# EAGLE design keyboard v2 (EAGLE 7.7.0)
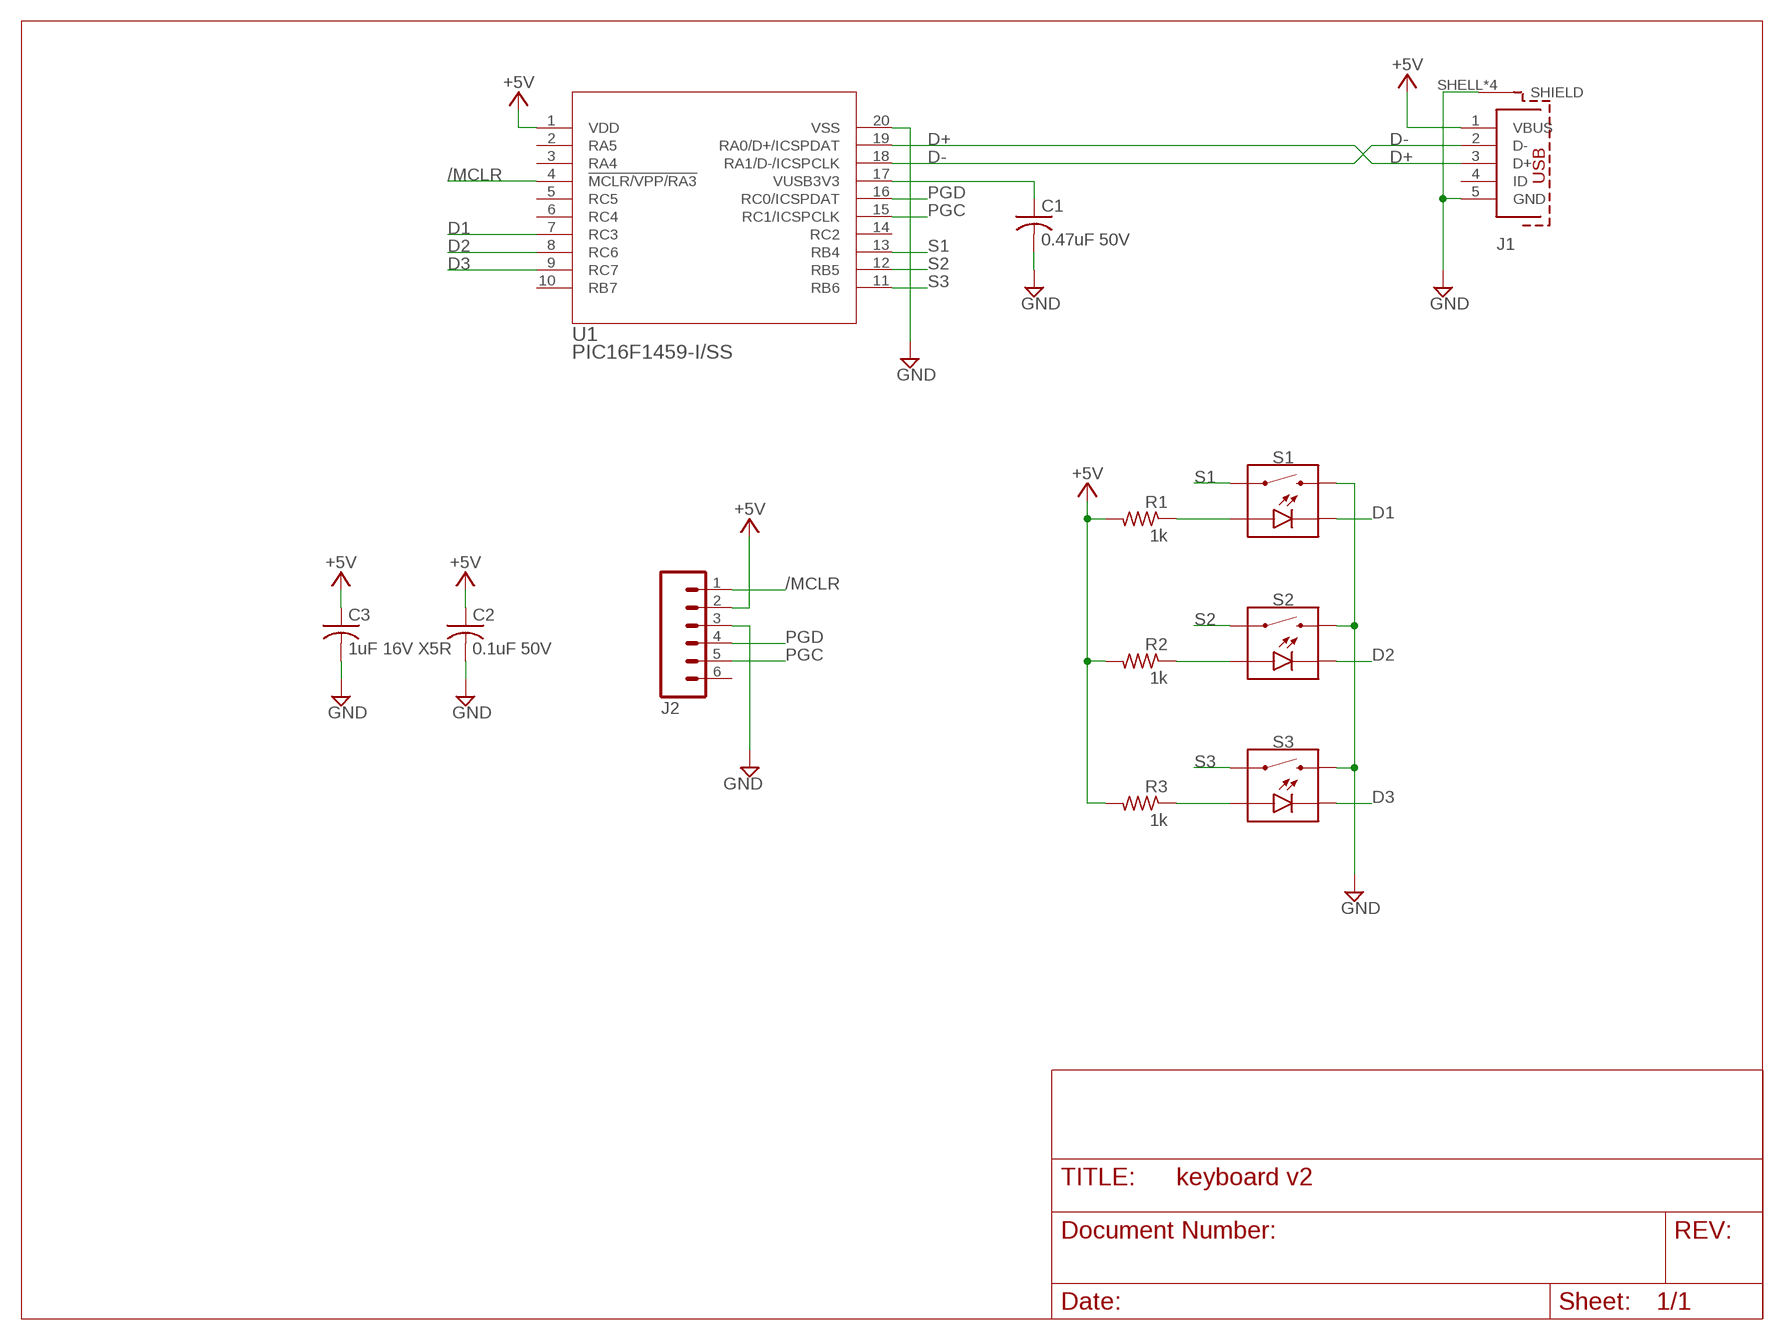
[diagram p0: schematic, sheet 1]

## Parts
C1  0.47uF 50V  C-USC1206K  [C1206K]
C2  0.1uF 50V  C-USC1206K  [C1206K]
C3  1uF 16V X5R  C-USC1210  [C1210]
J1  629105136821  [629105136821]
J2  M06SIP  [1X06]
R1  1k  R-US_R1206  [R1206]
R2  1k  R-US_R1206  [R1206]
R3  1k  R-US_R1206  [R1206]
S1  MOMENTARY-SWITCH-SPST-LED-PTH-CHERRY  [CHERRY-MX-LED]
S2  MOMENTARY-SWITCH-SPST-LED-PTH-CHERRY  [CHERRY-MX-LED]
S3  MOMENTARY-SWITCH-SPST-LED-PTH-CHERRY  [CHERRY-MX-LED]
U1  PIC16F1459-I/SS  [SSOP20_MC]

## Nets
+5V: C2.1 C3.1 J1.1(VBUS) J2.2 R1.2 R2.2 R3.2 U1.1(VDD)
/MCLR: J2.1 U1.4(!MCLR/VPP/RA3)
D1: S1.K(C) U1.7(RC3)
D2: S2.K(C) U1.8(RC6)
D3: S3.K(C) U1.9(RC7)
D+: J1.3(D+) U1.19(RA0/D+/ICSPDAT)
D-: J1.2(D-) U1.18(RA1/D-/ICSPCLK)
GND: C1.2 C2.2 C3.2 J1.5(GND) J1.SHELL1(SHIELD) J1.SHELL2(SHIELD) J1.SHELL3(SHIELD) J1.SHELL(SHIELD) J2.3 S1.S2 S2.S2 S3.S2 U1.20(VSS)
N$1: R1.1 S1.A
N$2: R2.1 S2.A
N$3: R3.1 S3.A
PGC: J2.5 U1.15(RC1/ICSPCLK)
PGD: J2.4 U1.16(RC0/ICSPDAT)
S1: S1.S1 U1.13(RB4)
S2: S2.S1 U1.12(RB5)
S3: S3.S1 U1.11(RB6)
VUSB: C1.1 U1.17(VUSB3V3)
Unconnected: J1.4(ID) J2.6 U1.2(RA5) U1.3(RA4) U1.5(RC5) U1.6(RC4) U1.10(RB7) U1.14(RC2)

## Library data of the parts
C1 = rcl:C-US: CAPACITOR, American symbol; MFR: KEMET; MFR_PART_NO: C1206C474K5RACTU
C2 = rcl:C-US: CAPACITOR, American symbol; MFR: KEMET; MFR_PART_NO: C1206S104M5RACTU
C3 = rcl:C-US: CAPACITOR, American symbol; MFR: KEMET; MFR_PART_NO: C1210C105K4PACTU
J1 = InputOutputIO (rev18a):629105136821: WR-COM SMT Horizontal 5 Contacts Micro USB Type B,5 pins=>Code : Con_I-O_COM_MicroUSB_629105136821 <http://katalog.we-online.de/media/images/eican/Con_I-O_COM_MicroUSB_629105136821_pf2.jpg> Details see: http://katalog.we-online.de/en/em/COM_MICRO_SMT_TYPE_B_HORIZONTAL/629105136821?m Created 2014-07-09, Karrer Zheng 2014 (C) Würth Elektronik
J2 = SparkFun-Connectors:M06: Header 6 Standard 6-pin 0.1" header. Use with straight break away headers (SKU : PRT-00116), right angle break away headers (PRT-00553), swiss pins (PRT-00743), machine pins (PRT-00117), and female headers (PRT-00115). Molex polarized connector foot print use with SKU : PRT-08094 with associated crimp pins and housings. NOTES ON THE VARIANTS LOCK and LOCK_LONGPADS... This footprint was designed to help hold the alignment of a through-hole component (i.e. 6-pin header) while soldering it into place. You may notice that each hole has been shifted either up or down by 0.005 of an inch from it's more standard position (which is a perfectly straight line). This slight alteration caused the pins (the squares in the middle) to touch the edges of the holes. Because they are alternating, it causes a "brace" to hold the component in place. 0.005 has proven to be the perfect amount of "off-center" position when using our standard breakaway headers. Although looks a little odd when you look at the bare footprint, once you have a header in there, the alteration is very hard to notice. Also,if you push a header all the way into place, it is covered up entirely on the bottom side. This idea of altering the position of holes to aid alignment will be further integrated into the Sparkfun Library for other footprints. It can help hold any component with 3 or more connection pins.
R1-R3 = rcl:R-US_: RESISTOR, American symbol; MFR: BOURNS; MFR_PART_NO: CR1206-JW-102ELF
S1-S3 = SparkFun-Switches:MOMENTARY-SWITCH-SPST-LED: Momentary Switch (Pushbutton) - SPST - w/ LED Normally-open (NO) SPST momentary switches (buttons, pushbuttons), with a built-in LED. Variants PTH-CHERRY - Cherry MX Switch Cherry MX Keyswitches are top-of-the-line mechanical keyboard switches. They’re satisfyingly “clicky”, reliable up to tens-of-millions of key presses, and a standard in gaming and programming keyboards across the globe. This ‘blue’ version Cherry MX Switch is favored by most due to its secondary internal actuator making it less likely to “double-tap.” If you are looking for a noticeably audible and high-quality key switch, this is the perfect option for you! Cherry MX Switch <https://www.sparkfun.com/products/13834> (COM-13834) Cherry MX Switch Breakout <https://www.sparkfun.com/products/13773> (BOB-13773) PTH-12MM and PTH-12MM-KIT - 12mm Illuminated LED KIT variant is for soldering kits. There is no tStop (covering up the top side of the pads with mask). This helps the beginner see which side they should be soldering too. LED Tactile Button Breakout <https://www.sparkfun.com/products/10467> (BOB-10467) LED Tactile Button - Red <https://www.sparkfun.com/products/10442> (COM-10442) LED Tactile Button - Blue <https://www.sparkfun.com/products/10443> (COM-10443) LED Tactile Button - Green <https://www.sparkfun.com/products/10440> (COM-10440) LED Tactile Button - Orange <https://www.sparkfun.com/products/10441> (COM-10441) LED Tactile Button - White <https://www.sparkfun.com/products/10439> (COM-10439); SF_ID: COM-13834
U1 = pic16f1459-i-ss:PIC16F1459-I/SS; MANUFACTURER_PART_NUMBER: PIC16F1459ISS; VENDOR: Microchip

## Board
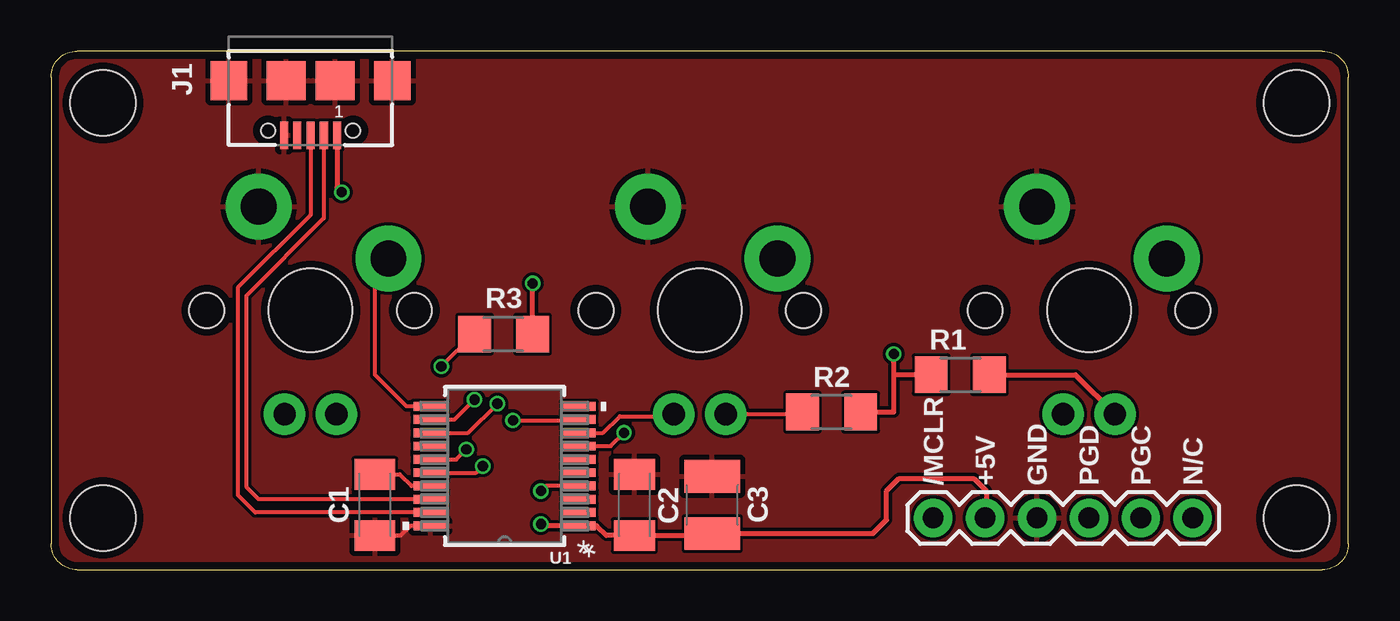
[diagram p1: board, top side]
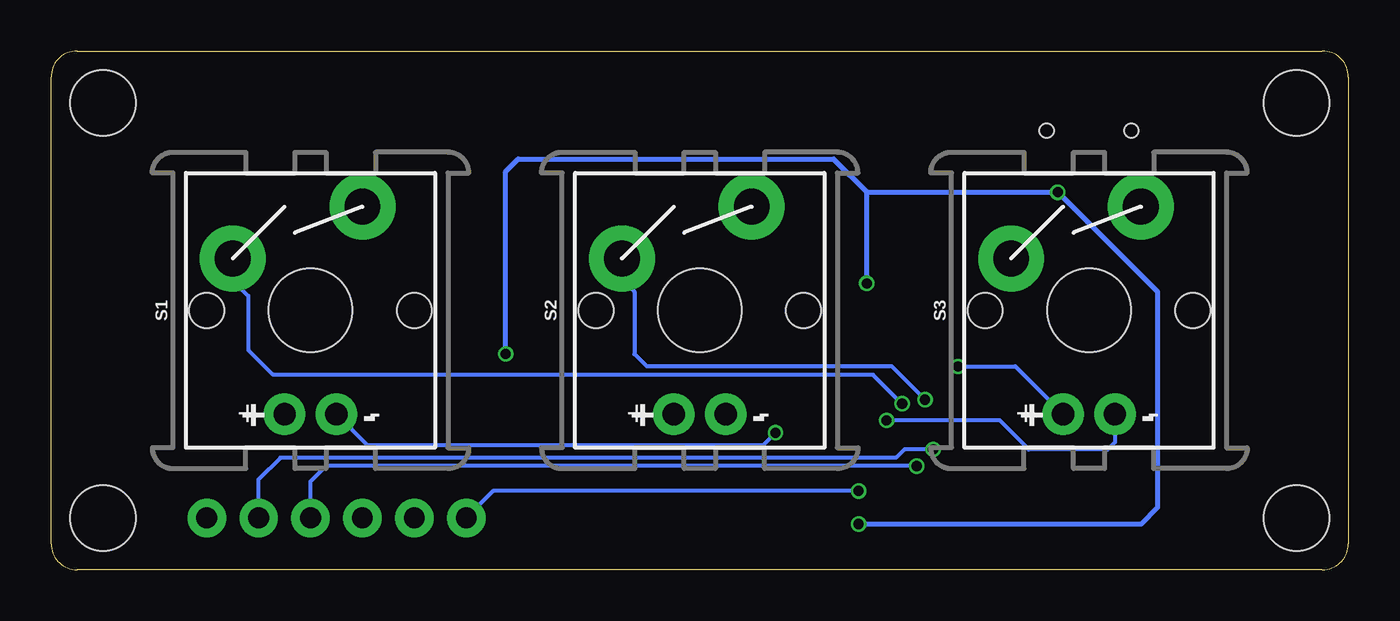
[diagram p2: board, bottom side, seen from below]

Size 63.5 x 25.4 mm. Coordinates in mm from the lower left corner, seen from the top.
Outline: 1.27,0 62.23,0 arc90 63.5,1.27 63.5,24.13 arc90 62.23,25.4 1.27,25.4 arc90 0,24.13 0,1.27 arc90 1.27,0
Copper layers (1*16): Top 0.035559375mm / dielectric 1.6mm / Bottom 0.035559375mm
Design rules "oshpark-2layer-2018": minimum track width 6mil, minimum drill 10mil, track to track 6mil, track to pad 6mil, pad to pad 6mil, via to via 6mil, smd to smd 6mil, copper to edge 15mil, drill to drill 6mil, minimum pad ring 5mil, minimum via ring 5mil, stop-mask expansion 2.5mil, vias tented up to drill 0mil, thermal gap 10mil
Holes 3.2 mm at 2.54,2.54 2.54,22.86 60.96,22.86 60.96,2.54

### Footprints (pad centres in the part's own frame; a part is rotated, then mirrored left to right if it is on the bottom)
C1206K = smd 1.5 x 2: 1 -1.5,0; 2 1.5,0
C1210 = smd 1.6 x 2.7: 1 -1.4,0; 2 1.4,0
629105136821 = smd 0.4 x 1.35: 1 -1.3,2.675; 2 -0.65,2.675; 3 0,2.675; 4 0.65,2.675; 5 1.3,2.675 | smd 1.8 x 1.9: SHELL -4,0; SHELL3 4,0 | smd 1.9 x 1.9: SHELL1 -1.2,0; SHELL2 1.2,0 | hole 0.7: -2.075,2.45; 2.075,2.45
1X06 = drill 1.016 pad 1.88: 1 0,0; 2 2.54,0; 3 5.08,0; 4 7.62,0; 5 10.16,0; 6 12.7,0
R1206 = smd 1.6 x 1.803: 1 -1.422,0; 2 1.422,0
CHERRY-MX-LED = drill 1.092 pad 2.032: A -1.27,-5.08; K 1.27,-5.08 | drill 1.753 pad 3.226: S1 -3.81,2.54; S2 2.54,5.08 | hole 4.089: 0,0 | hole 1.707: -5.08,0; 5.08,0
SSOP20_MC = smd 1.651 x 0.432: 1 -3.632,2.925; 2 -3.632,2.275; 3 -3.632,1.625; 4 -3.632,0.975; 5 -3.632,0.325; 6 -3.632,-0.325; 7 -3.632,-0.975; 8 -3.632,-1.625; 9 -3.632,-2.275; 10 -3.632,-2.925; 11 3.632,-2.925; 12 3.632,-2.275; 13 3.632,-1.625; 14 3.632,-0.975; 15 3.632,-0.325; 16 3.632,0.325; 17 3.632,0.975; 18 3.632,1.625; 19 3.632,2.275; 20 3.632,2.925

### Placement (x,y rotation side)
C1  15.85,3.17 270 top
C2  28.55,3.17 90 top
C3  32.36,3.17 90 top
J1  12.7,23.95 180 top
J2  43.18,2.54 0 top
R1  44.5,9.55 180 top
R2  38.2,7.72 0 top
R3  22.15,11.53 0 top
S1  50.8,12.7 0 bottom
S2  31.75,12.7 0 bottom
S3  12.7,12.7 0 bottom
U1  22.2,5.08 180 top

### Tracks (layer width: path | path; a pad name or v marks a point on that pad's centre or on a via)
+5V  (via drill 0.5)
  Top 0.203: 32.26,1.68 C3.1 | 45.77,2.49 J2.2 45.77,2.59 | v23.57,14.02
  Top 0.254: 32.26,1.68 C2.1 27.18,1.68 26.7,2.15 U1.1 24.06,2.15 v23.98,2.23 | C3.1 40.23,1.77 40.89,2.44 40.89,3.86 41.5,4.47 45.16,4.47 45.77,3.86 45.77,2.59 | J1.1 14,18.71 v14.22,18.49 | R3.2 v23.57,14.02 | R2.2 41.25,7.72 41.25,9.55 | 41.25,9.55 v41.25,10.57 | R1.2 41.25,9.55
  Bottom 0.254: v23.98,2.23 10.16,2.23 9.35,3.05 9.35,13.61 v14.22,18.49 23.57,18.49 | v23.57,14.02 23.57,18.49 | v41.25,10.57 41.25,19.51 40.64,20.12 25.2,20.12 23.57,18.49
/MCLR  (via drill 0.5)
  Top 0.203: U1.4 24.22,4.11 v23.98,3.86
  Bottom 0.203: v23.98,3.86 41.86,3.86 J2.1
D1  (via drill 0.5)
  Top 0.203: U1.7 27.39,6.05 v28.04,6.71
  Bottom 0.203: v28.04,6.71 28.65,6.1 48.01,6.1 S1.K
D2
  Top 0.203: U1.8 27.02,6.71 27.84,7.52 30.38,7.52 S2.K
D3  (via drill 0.5)
  Top 0.203: v22.61,7.32 25.79,7.32 U1.9
  Bottom 0.203: S3.K 11.43,6.25 11.79,5.89 15.65,5.89 17.07,7.32 v22.61,7.32
D+
  Top 0.203: J1.3 12.7,17.37 9.14,13.82 9.14,3.66 10,2.81 U1.19
D-
  Top 0.203: J1.2 13.35,17.21 9.55,13.41 9.55,4.06 10.16,3.45 10.16,3.46 U1.18
GND
  Top 0.203: C1.2 17.12,1.68 17.6,2.15 U1.20
  pour Top: 0,25.4 63.5,25.4 63.5,0 0,0
N$1
  Top 0.254: R1.1 50.14,9.55 S1.A
N$2
  Top 0.203: S2.A 36.68,7.62 R2.1
N$3  (via drill 0.5)
  Top 0.203: R3.1 20.68,11.53 v19.1,9.96
  Bottom 0.203: v19.1,9.96 16.31,9.96 S3.A
PGC  (via drill 0.5)
  Top 0.203: U1.15 19.83,5.41 v20.32,5.89
  Bottom 0.203: v20.32,5.89 21.74,5.89 22.15,5.49 52.27,5.49 53.34,4.42 J2.5
PGD  (via drill 0.5)
  Top 0.203: U1.16 20.81,4.75 v21.13,5.08
  Bottom 0.203: v21.13,5.08 50.04,5.08 50.8,4.32 J2.4
S1  (via drill 0.5)
  Top 0.203: U1.13 20.42,6.71 v21.84,8.13
  Bottom 0.203: v21.84,8.13 23.27,9.55 52.63,9.55 53.85,10.77 53.85,13.41 54.61,14.17 S1.S1
S2  (via drill 0.5)
  Top 0.203: U1.12 19.75,7.36 v20.73,8.33
  Bottom 0.203: v20.73,8.33 22.35,9.96 34.34,9.96 34.95,10.57 34.95,13.61 35.56,14.22 S2.S1
S3
  Top 0.203: U1.11 17.39,8.01 15.85,9.55 15.85,14.58 S3.S1
VUSB
  Top 0.203: C1.1 17.07,4.67 17.64,4.11 U1.17

### Text on the board
_tsilk: J1 | 1 | R3 | R1 | R2 | /MCLR | +5V | GND | PGD | PGC | N/C | C1 | C2 | C3 | U1 | *
_bsilk: - | + | - | + | - | +